# Altium project ESP8266-12E_breakout.PrjPcb
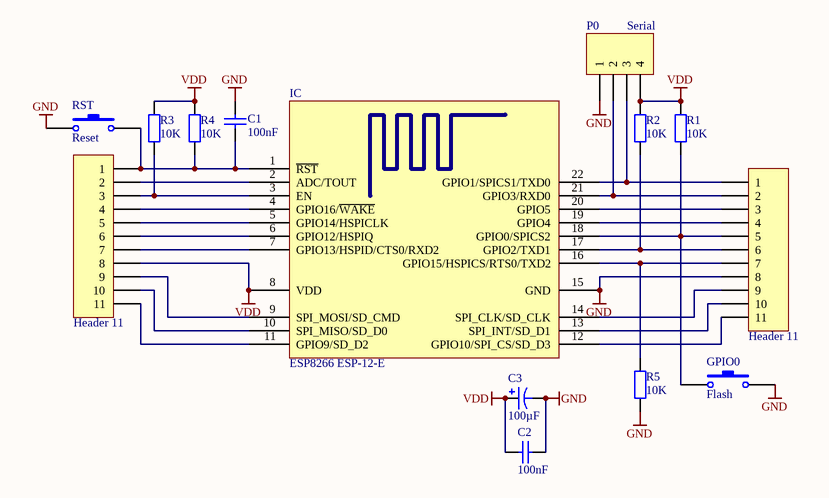
[diagram p0: Schematic.SchDoc]
1 sheet, 14 parts. Net scope: global (net labels, ports and power ports of the same name join across sheets).
Board files: ESP12E.PcbDoc, PCB.PcbDoc

## Sheet Schematic.SchDoc
size A4

### Parts
C1  value 100nF  [C1206]  (hidden comment: Cap Semi)
C2  value 100nF  [C1206]  (hidden comment: Cap Semi)
C3  value 100µF  [SMD cap 6x5]
GPIO0  Flash  [SMDswitch]
IC  ESP8266 ESP-12-E  [ESP8266 ESP-12-E]
P0  Serial  [HDR1X4]
P1  Header 11  [HDR1X11]
P2  Header 11  [HDR1X11]
R1  value 10K  [C1206]  (hidden comment: Res2)
R2  value 10K  [C1206]  (hidden comment: Res2)
R3  value 10K  [C1206]  (hidden comment: Res2)
R4  value 10K  [C1206]  (hidden comment: Res2)
R5  value 10K  [C1206]  (hidden comment: Res2)
RST  Reset  [SMDswitch]

### Nets
GND: C1.2 C2.2 C3.2 GPIO0.2 IC.15(GND) P0.1 P2.8 R5.1 RST.1
VDD: C2.1 C3.1 IC.8(VDD) P0.4 P1.8 R1.2 R2.2 R3.2 R4.2
NetC1_1: C1.1 IC.1(~{RST}) P1.1 R4.1 RST.2
NetGPIO0_1: GPIO0.1 IC.18(GPIO0/SPICS2) P2.5 R1.1
NetIC_2: IC.2(ADC/TOUT) P1.2
NetIC_3: IC.3(EN) P1.3 R3.1
NetIC_4: IC.4(GPIO16/~{WAKE}) P1.4
NetIC_5: IC.5(GPIO14/HSPICLK) P1.5
NetIC_6: IC.6(GPIO12/HSPIQ) P1.6
NetIC_7: IC.7(GPIO13/HSPID/CTS0/RXD2) P1.7
NetIC_9: IC.9(SPI_MOSI/SD_CMD) P1.9
NetIC_10: IC.10(SPI_MISO/SD_D0) P1.10
NetIC_11: IC.11(GPIO9/SD_D2) P1.11
NetIC_12: IC.12(GPIO10/SPI_CS/SD_D3) P2.11
NetIC_13: IC.13(SPI_INT/SD_D1) P2.10
NetIC_14: IC.14(SPI_CLK/SD_CLK) P2.9
NetIC_16: IC.16(GPIO15/HSPICS/RTS0/TXD2) P2.7 R5.2
NetIC_17: IC.17(GPIO2/TXD1) P2.6 R2.1
NetIC_19: IC.19(GPIO4) P2.4
NetIC_20: IC.20(GPIO5) P2.3
NetIC_21: IC.21(GPIO3/RXD0) P0.2 P2.2
NetIC_22: IC.22(GPIO1/SPICS1/TXD0) P0.3 P2.1

### Library data of the parts
C1 C2 = Cap Semi: Capacitor (Semiconductor SIM Model); Published: 8-Jun-2000; LatestRevisionDate: 29-May-2009; LatestRevisionNote: IPC-7351 Footprint Added.; PackageReference: C1206; Publisher: Altium Limited; PackageDescription: Chip Capacitor
C3 = Cap Pol1: Polarized Capacitor (Radial); Published: 8-Jun-2000; LatestRevisionDate: 17-Jul-2002; LatestRevisionNote: Re-released for DXP Platform.; PackageReference: RB7.6-15; Publisher: Altium Limited; PackageDescription: Polarized Capacitor (Radial); 2 Leads
GPIO0 RST = SW-PB: Switch; Published: 24-Mar-1999; LatestRevisionDate: 17-Jul-2002; LatestRevisionNote: Re-released for DXP Platform.; PackageReference: SPST-2; Publisher: Altium Limited; PackageDescription: Switch; 2 Leads
P0 = Header 4: Header, 4-Pin; LatestRevisionDate: 17-Jul-2002; LatestRevisionNote: Re-released for DXP Platform.; Publisher: Altium Limited
P1 P2 = Header 11: Header, 11-Pin; LatestRevisionDate: 17-Jul-2002; LatestRevisionNote: Re-released for DXP Platform.; Publisher: Altium Limited
R1-R5 = Res2: Resistor; Published: 8-Jun-2000; LatestRevisionDate: 17-Jul-2002; LatestRevisionNote: Re-released for DXP Platform.; PackageReference: AXIAL-0.4; Publisher: Altium Limited; PackageDescription: Axial Device, Thru-Hole; 2 Leads; 0.4 in Pin Spacing